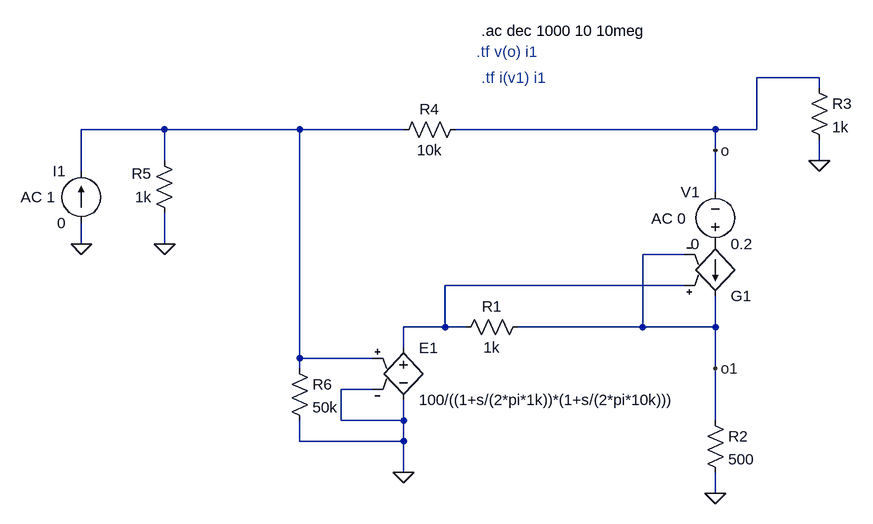
[diagram p0: schematic pruebametodo1.asc]
pruebametodo1.asc, the LTspice schematic file:
Version 4
SHEET 1 1112 1092
WIRE 880 -288 784 -288
WIRE 880 -272 880 -288
WIRE -128 -208 -256 -208
WIRE 80 -208 -128 -208
WIRE 240 -208 80 -208
WIRE 720 -208 320 -208
WIRE 784 -208 784 -288
WIRE 784 -208 720 -208
WIRE 720 -176 720 -208
WIRE -128 -160 -128 -208
WIRE 880 -160 880 -192
WIRE -256 -144 -256 -208
WIRE 720 -112 720 -176
WIRE -256 -32 -256 -64
WIRE -128 -32 -128 -80
WIRE 672 -16 608 -16
WIRE 672 32 304 32
WIRE 304 96 304 32
WIRE 304 96 240 96
WIRE 336 96 304 96
WIRE 608 96 608 -16
WIRE 608 96 416 96
WIRE 720 96 720 48
WIRE 720 96 608 96
WIRE 240 128 240 96
WIRE 80 144 80 -208
WIRE 192 144 80 144
WIRE 80 160 80 144
WIRE 720 160 720 96
WIRE 192 192 144 192
WIRE 144 240 144 192
WIRE 240 240 240 208
WIRE 240 240 144 240
WIRE 720 240 720 160
WIRE 80 272 80 240
WIRE 240 272 240 240
WIRE 240 272 80 272
WIRE 240 320 240 272
WIRE 720 352 720 320
FLAG 240 320 0
FLAG 720 352 0
FLAG 880 -160 0
FLAG -256 -32 0
FLAG 720 160 o1
FLAG -128 -32 0
FLAG 720 -176 o
SYMBOL e 240 112 R0
SYMATTR InstName E1
SYMATTR Value 100/((1+s/(2*pi*1k))*(1+s/(2*pi*10k)))
SYMATTR SpiceModel laplace
SYMBOL res 320 112 R270
WINDOW 0 32 56 VTop 2
WINDOW 3 0 56 VBottom 2
SYMATTR InstName R1
SYMATTR Value 1k
SYMBOL g 720 64 M180
SYMATTR InstName G1
SYMATTR Value 0.2
SYMBOL res 704 224 R0
SYMATTR InstName R2
SYMATTR Value 500
SYMBOL res 864 -288 R0
SYMATTR InstName R3
SYMATTR Value 1k
SYMBOL res 336 -224 R90
WINDOW 0 0 56 VBottom 2
WINDOW 3 32 56 VTop 2
SYMATTR InstName R4
SYMATTR Value 10k
SYMBOL res -112 -64 R180
WINDOW 0 36 76 Left 2
WINDOW 3 36 40 Left 2
SYMATTR InstName R5
SYMATTR Value 1k
SYMBOL res 64 144 R0
SYMATTR InstName R6
SYMATTR Value 50k
SYMBOL current -256 -64 R180
WINDOW 0 24 80 Left 2
WINDOW 3 24 0 Left 2
WINDOW 123 40 40 Left 2
WINDOW 39 0 0 Left 0
SYMATTR InstName I1
SYMATTR Value 0
SYMATTR Value2 AC 1
SYMBOL voltage 720 -16 R180
WINDOW 0 24 96 Left 2
WINDOW 3 24 16 Left 2
WINDOW 123 45 55 Left 2
WINDOW 39 0 0 Left 0
SYMATTR InstName V1
SYMATTR Value 0
SYMATTR Value2 AC 0
TEXT 352 -328 Left 2 ;.tf v(o) i1
TEXT 360 -288 Left 2 ;.tf i(v1) i1
TEXT 360 -360 Left 2 !.ac dec 1000 10 10meg

The netlist it stands for:
* pruebametodo1.asc
E1 N002 0 N001 0 laplace 100/((1+s/(2*pi*1k))*(1+s/(2*pi*10k)))
R1 N002 o1 1k
G1 P001 o1 N002 o1 0.2
R2 o1 0 500
R3 o 0 1k
R4 o N001 10k
R5 0 N001 1k
R6 N001 0 50k
I1 0 N001 0 AC 1
V1 P001 o 0 AC 0
* .tf v(o) i1
* .tf i(v1) i1
.ac dec 1000 10 10meg
.backanno
.end